# Altium project ODB2_scanner_PCB_Altium.PrjPcb
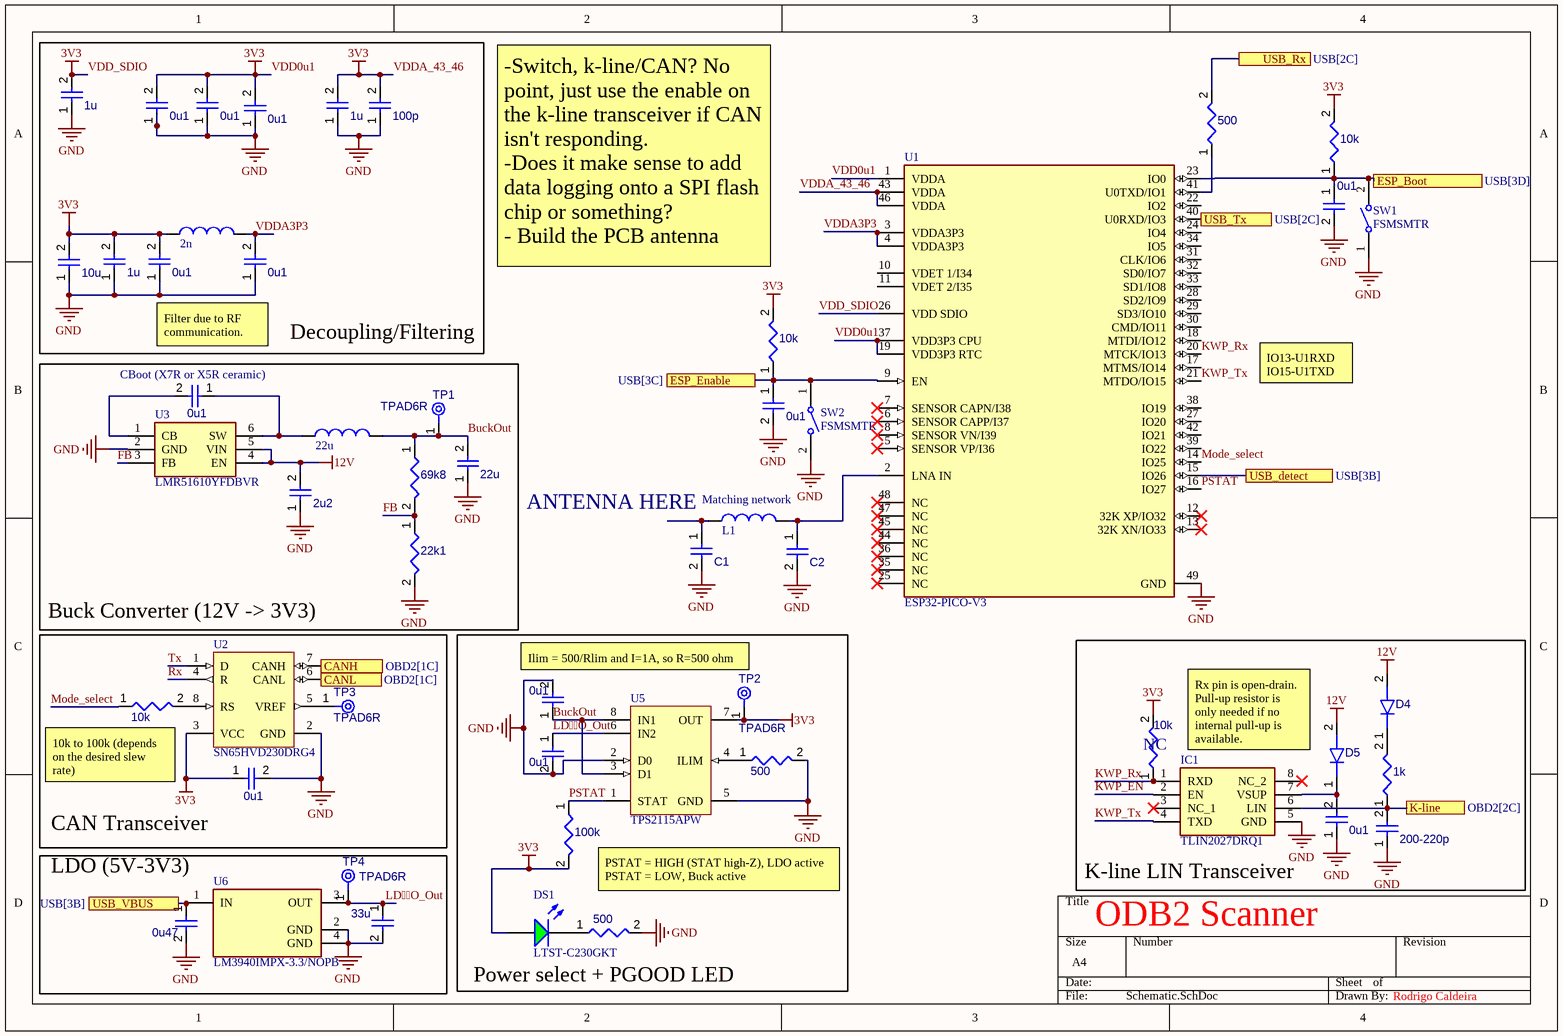
[diagram p0: Schematic.SchDoc]
3 sheets, 87 parts. Net scope: flat (ports and power ports of the same name join across sheets).
Sheets:
  Schematic.SchDoc
  USB.SchDoc
  OBD2.SchDoc

## Sheet Schematic.SchDoc
size A4; SheetNumber: 1; SheetTotal: 3

### Parts
(Parts that share a designator on the sheet are numbered #1, #2 ... from top to bottom, then left to right.)
0u1#1  Capacitors  (value not drawn)
0u1#2  Capacitors  (value not drawn)
0u1#3  Capacitors  (value not drawn)
0u1#4  Capacitors  (value not drawn)
0u1#5  Capacitors  (value not drawn)
0u1#6  Capacitors  (value not drawn)
0u1#7  Capacitors  (value not drawn)
0u1#8  Capacitors  (value not drawn)
0u1#9  Capacitors  (value not drawn)
0u1#10  Capacitors  (value not drawn)
0u1#11  Capacitors  (value not drawn)
0u1#12  Capacitors  (value not drawn)
0u47  Capacitors  (value not drawn)
1k#1  Resistors  (value not drawn)
1u#1  Capacitors  (value not drawn)
1u#2  Capacitors  (value not drawn)
1u#3  Capacitors  (value not drawn)
2n  Inductors  (value not drawn)
2u2  Capacitors  (value not drawn)
10k#1  Resistors  (value not drawn)
10k#2  Resistors  (value not drawn)
10k#3  Resistors  (value not drawn)
10k#4  Resistors  (value not drawn)
10u  Capacitors  (value not drawn)
22k1  Resistors  (value not drawn)
22u#1  Inductors  (value not drawn)
22u#2  Capacitors  (value not drawn)
33u  Capacitors  (value not drawn)
69k8  Resistors  (value not drawn)
100k#1  Resistors  (value not drawn)
100p  Capacitors  (value not drawn)
200-220p  Capacitors  (value not drawn)
500#1  Resistors  (value not drawn)
500#2  Resistors  (value not drawn)
500#3  Resistors  (value not drawn)
C1  Capacitors  (value not drawn)
C2  Capacitors  (value not drawn)
D4  Diodes  (value not drawn)
D5  Diodes  (value not drawn)
DS1  LTST-C230GKT  [LTST-C230KGKT_V]
IC1  TLIN2027DRQ1  [SOIC127P600X175-8N]
L1  Inductors  (value not drawn)
SW1  FSMSMTR  [TECO-FSMSMTR_V]
SW2  FSMSMTR  [TECO-FSMSMTR_V]
TP1  TPAD6R  [TP06R]  (no BOM)
TP2  TPAD6R  [TP06R]  (no BOM)
TP3  TPAD6R  [TP06R]  (no BOM)
TP4  TPAD6R  [TP06R]  (no BOM)
U1  ESP32-PICO-V3  [FP-ESP32-PICO-V3-MFG]
U2  SN65HVD230DRG4  [D8_N]
U3  LMR51610YFDBVR  [SOT95P280X145-6N]
U5  TPS2115APW  [PW0008A_M]
U6  LM3940IMPX-3.3/NOPB  [FP-DCY0004A-MFG]

### Blocks framed on the sheet
Decoupling/Filtering: 0u1#1-0u1#3 0u1#5 0u1#6 1u#1-1u#3 2n 10u 100p
Power select + PGOOD LED: 0u1#9 0u1#10 100k#1 500#2 500#3 DS1 TP2 U5
K-line LIN Transceiver: 0u1#12 1k#1 10k#4 200-220p D4 D5 IC1

### Ports
CANH (see OBD2[1C]), CANL (see OBD2[1C]), ESP_Boot (see USB[3D]), ESP_Enable (see USB[3C]), K-line (see OBD2[2C]), USB_detect (see USB[3B]), USB_Rx (see USB[2C]), USB_Tx (see USB[2C]), USB_VBUS (see USB[3B])

### Nets
12V: 2u2.2 D4.2(A) D5.2(A) U3.4(EN) U3.5(VIN)
GND: 0u1#1.1 0u1#2.1 0u1#3.1 0u1#4.2 0u1#5.1 0u1#6.1 0u1#7.2 0u1#9.2 0u1#10.2 0u1#11.2 0u1#12.1 0u47.2 1u#1.1 1u#2.1 1u#3.1 2u2.1 10u.1 22k1.2 22u#2.1 33u.2 100p.1 200-220p.1 500#2.2 500#3.2 C1.2 C2.2 IC1.5(GND) SW1.1 SW2.2 U1.49(GND) U2.2(GND) U3.2(GND) U5.2(D0) U5.5(GND) U6.2(GND) U6.4(GND)
VDD0u1: 0u1#1.2 0u1#2.2 0u1#3.2 0u1#5.2 0u1#11.1 1u#1.2 1u#2.2 1u#3.2 2n.1 10k#1.2 10k#2.2 10k#4.2 10u.2 100k#1.2 100p.2 DS1.1(A) TP2.1(TP) U1.1(VDDA) U1.19(VDD3P3_RTC) U1.26(VDD_SDIO) U1.37(VDD3P3_CPU) U1.43(VDDA) U1.46(VDDA) U2.3(VCC) U5.7(OUT)  [also labelled 3V3, VDD_SDIO, VDDA_43_46]
BuckOut: 0u1#9.1 22u#1.2 22u#2.2 69k8.1 TP1.1(TP) U5.3(D1) U5.8(IN1)
FB: 22k1.1 69k8.2 U3.3(FB)
KWP_EN: IC1.2(EN)
KWP_Rx: 10k#4.1 IC1.1(RXD) U1.20(MTCK/IO13)
KWP_Tx: IC1.4(TXD) U1.21(MTDO/IO15)
LDO_Out: 0u1#10.1 33u.1 TP4.1(TP) U5.6(IN2) U6.3(OUT)
Mode_select: 10k#3.1 U1.14(IO25)
PSTAT: 100k#1.1 U1.16(IO27) U5.1(STAT)
Rx: U2.4(R)
Tx: U2.1(D)
VBUS: 0u47.1 U6.1(IN) ; port USB_VBUS
VDDA3P3: 0u1#6.2 2n.2 U1.3(VDDA3P3) U1.4(VDDA3P3)
Net0u1#4_1: 0u1#4.1 10k#1.1 SW1.2 U1.23(IO0) ; port ESP_Boot
Net0u1#7_1: 0u1#7.1 10k#2.1 SW2.1 U1.9(EN) ; port ESP_Enable
Net0u1#8_1: 0u1#8.1 22u#1.1 U3.6(SW)
Net0u1#8_2: 0u1#8.2 U3.1(CB)
Net0u1#12_2: 0u1#12.2 D5.1(K) IC1.7(VSUP)
Net1k#1_1: 1k#1.1 200-220p.2 IC1.6(LIN) ; port K-line
Net1k#1_2: 1k#1.2 D4.1(K)
Net10k#3_2: 10k#3.2 U2.8(RS)
Net52k_2: U1.15(IO26) ; port USB_detect
Net500#1_1: 500#1.1 U1.41(U0TXD/IO1)
Net500#1_2: 500#1.2 ; port USB_Rx
Net500#2_1: 500#2.1 U5.4(ILIM)
Net500#3_1: 500#3.1 DS1.2(K)
NetC1_1: C1.1 L1.1
NetC2_1: C2.1 L1.2 U1.2(LNA_IN)
NetJ1_6: U2.7(CANH) ; port CANH
NetJ1_14: U2.6(CANL) ; port CANL
NetTP3_1: TP3.1(TP) U2.5(VREF)
NetU1_40: U1.40(U0RXD/IO3) ; port USB_Tx

Not connected (* = marked no-connect by the designer): IC1 3(NC_1)* 8(NC_2)*; U1 5(SENSOR_VP/I36)* 6(SENSOR_CAPP/I37)* 7(SENSOR_CAPN/I38)* 8(SENSOR_VN/I39)* 10(VDET_1/I34) 11(VDET_2/I35) 12(32K_XP/IO32)* 13(32K_XN/IO33)* 17(MTMS/IO14) 18(MTDI/IO12) 22(IO2) 24(IO4) 25(NC)* 27(IO20) 28(SD2/IO9) 29(SD3/IO10) 30(CMD/IO11) 31(CLK/IO6) 32(SD0/IO7) 33(SD1/IO8) 34(IO5) 35(NC)* 36(NC)* 38(IO19) 39(IO22) 42(IO21) 44(NC)* 45(NC)* 47(NC)* 48(NC)*

### Notes on the sheet
- -Switch, k-line/CAN? No point, just use the enable on the k-line transceiver if CAN isn't responding.
  -Does it make sense to add data logging onto a SPI flash chip or something?
  - Build the PCB antenna
- (near 0u1#8) CBoot (X7R or X5R ceramic)
- (near 0u1#6) Filter due to RF communication.
- IO13-U1RXD
  IO15-U1TXD
- ANTENNA HERE
- (near L1) Matching network
- (near U2) Buck Converter (12V -> 3V3)
- Ilim = 500/Rlim and I=1A, so R=500 ohm
- (near 10k#3) 10k to 100k (depends on the desired slew rate)
- (near 10k#4) NC
- Rx pin is open-drain. Pull-up resistor is only needed if no internal pull-up is available.
- CAN Transceiver
- LDO (5V-3V3)
- PSTAT = HIGH (STAT high-Z), LDO active
  PSTAT = LOW, Buck active
- ODB2 Scanner
- Rodrigo Caldeira

### Library data of the parts
0u1#1-0u1#12 0u47 1u#1-1u#3 2u2 22u#2 33u 100p 200-220p C1 C2 = Capacitors: Capacitor; Component Type: Capacitors
1k#1 10k#1-10k#4 22k1 69k8 100k#1 500#1-500#3 = Resistors: Resistor; Component Type: Resistors
10u = Capacitors: Polarized Electrolitic Capacitor; Component Type: Capacitors
D4 D5 = Diodes: Diode; Component Type: Diodes
DS1 = CMP-2000-06625-1: LED Green, 75 mW, 30 mA, -30 to 85 degC, 2-Pin SMD, RoHS, Tape and Reel; Manufacturer: Lite-On; Product Length (mm): 3.2mm; Type: Uni-Color; Peak Wavelength: 574nm; Shape Type: Rectangular; DELETED: Compliant; Lum Intensity: 35mcd; Forward Voltage: 2.4V; High Brightness: Yes; Rad Hardened: No; Power Dissipation: 75W; Forward Current: 30mA; Emitting Color: YellowGreen; Main Category: ChipLED; Product Height (mm): 1.1mm; Product Depth (mm): 1.6mm; Number of  Elements: 1; Viewing Angle: 130deg; Chip Material: AlGaInP; Dominant Wave Length: 571nm; Test Current (It): 20mA; Reverse Voltage: 5V; Mounting: SurfaceMount; Datasheet URL: http://optoelectronics.liteon.com/upload/download/DS22-2000-256/S_110_LTST-C230KGKT.pdf; Luminous Intensity: 35mcd; Pin Count: 2; Mounting Technology: SurfaceMount; Operating Temperature Classification: Industrial; Operating Temp Range: -55Cto85C; Package Type: ChipLed; Manufacturer URL: http://www.us.liteon.com/; Package Description: 2-Pin Surface Mount Device, Body 3.2 x 1.6 mm; Package Reference: C230KGKT; Datasheet Version: Rev. G, 12/2014; Lens Dimensions: 1.5X1.6X0.82mm; Packaging: TapeandReel
IC1 = TLIN2027DRQ1: Integrated Circuit; Manufacturer_Name: Texas Instruments; Datasheet Link: https://www.arrow.com/en/products/tlin2027drq1/texas-instruments; Height: 1.75mm; Manufacturer_Part_Number: TLIN2027DRQ1; Mouser Part Number: 595-TLIN2027DRQ1; Mouser Price/Stock: https://www.mouser.co.uk/ProductDetail/Texas-Instruments/TLIN2027DRQ1?qs=81r%252BiQLm7BR5Em8N%252BNvRQg%3D%3D; Arrow Part Number: TLIN2027DRQ1; Arrow Price/Stock: https://www.arrow.com/en/products/tlin2027drq1/texas-instruments?region=nac
SW1 SW2 = CMP-2000-07501-1: FSMSM Push Button Switch, 50 mA, -35 to 85 degC, 2-Pin SMD, RoHS, Tape and Reel; Manufacturer: TE Connectivity; Voltage Rating (DC): 24V; Electrical Life: 20000Cycles; Operating Force: 180gf; Switch Travel: 0.25mm; Contact Current Rating: 50mA; Case\/Package: SMD/SMT; Actuator Length: 1.07mm; Throw Configuration: SPST; Actuator Material: Polyamide; Contact Resistance: 100mOhm; Illumination Type: Illuminated; Max Voltage Rating (DC): 12V; Manufacturer URL: http://www.te.com/; Lead Free: LeadFree; Packaging: TapeandReel; Min Operating Temperature: -35degC; Mechanical Life: 20000Cycles; Mount: SurfaceMount; REACH SVHC: Unknown; Package Quantity: 1800; Package Reference: FSMSMTR; RoHSCompliant: true; Max Operating Temperature: 85degC; Orientation: Straight; ELV: Compliant; Datasheet URL: http://www.te.com/commerce/DocumentDelivery/DDEController?Action=showdoc&DocId=Customer+Drawing%7F1437566-3%7FC2%7Fpdf%7FEnglish%7FENG_CD_1437566-3_C2_1437566_3_1_c.dwg.pdf%7F1437566-4; Package Description: 2-Pin Surface Mount Device, Body 6 x 3.5 mm, Pitch 9.19 mm; Current Rating: 50mA; Contact Plating: Silver; Termination: GullWing; Datasheet Version: Rev. C2, 08/2014; Contact Material: Brass; Mounting Technology: SurfaceMount
TP1-TP4 = CMP-00028-00002-2: 0.6mm round; Pins: 1
U1 = CMP-194065-000030-1: RX TXRX MOD WIFI SURFACE MOUNT
U2 = CMP-0315-00017-1: 3.3 V CAN Transceiver with Standby Mode, 17 mA, -40 to 85 degC, 8-pin SOIC (D), Green (RoHS & no Sb/Br); Manufacturer: Texas Instruments; Receivers Per Package: 1; Rating: Catalog; Transient Pulse Protection(V): -25 to 25; Supply Voltage(s)(V): 3.3; ICC(Max)(mA): 17; Code_JEDEC: MS-012AA; PackageVersion: revM, Jun-2011; Eco-Plan: Green (RoHS & no Sb/Br); SubFamily: CAN; ComponentLink1Description: Datasheet; Footprint: PCA82C250; PackageReference: D8; PartNumber: SN65HVD230DRG4; DatasheetVersion: SLOS346K; Mounting Technology: Surface Mount; ComponentLink1URL: http://www.ti.com/general/docs/lit/getliterature.tsp?genericPartNumber=SN65HVD230&fileType=pdf; Isolated: No; Drivers Per Package: 1; PackageDescription: 8-Pin Plastic Small Outline Integrated Circuit, 4.9 x 3.9 mm, Pitch 1.27 mm Pitch; Low Power Mode: Standby
U3 = LMR51610YFDBVR: Integrated Circuit; Manufacturer_Name: Texas Instruments; Datasheet Link: https://www.ti.com/lit/ds/symlink/lmr51610.pdf?ts=1727151330338&ref_url=https%253A%252F%252Fwww.mouser.in%252F; Height: 1.45mm; Manufacturer_Part_Number: LMR51610YFDBVR; Mouser Part Number: 595-LMR51610YFDBVR; Mouser Price/Stock: https://www.mouser.co.uk/ProductDetail/Texas-Instruments/LMR51610YFDBVR?qs=dbcCsuKDzFWbILGJVHCR7g%3D%3D; Arrow Part Number: LMR51610YFDBVR; Arrow Price/Stock: https://www.arrow.com/en/products/lmr51610yfdbvr/texas-instruments?utm_currency=USD&region=nac
U5 = CMP-0339-00017-2: Dual In / Single Out Autoswitching Power Mux, 2.8 to 5.5 V, -40 to 85 degC, 8-pin TSSOP (PW), Green (RoHS & no Sb/Br); Manufacturer: Texas Instruments; Number of Inputs: 2; IN1, IN2 Input Voltage(Min)(V): 2.8; IN1 Output Current(Max)(A): 1.25; SubFamily: Power Multiplexer (MUX); IN1, IN2 Input Voltage(Max)(V): 5.5; IN1 rDS(on)(Typ)(mOhm): 84; IN2 rDS(on)(Typ)(Ohms): 0.084; ComponentLink1URL: http://www.ti.com/general/docs/lit/getliterature.tsp?genericPartNumber=TPS2115A&fileType=pdf; Code_JEDEC: MO-153; Eco-Plan: Green (RoHS & no Sb/Br); PackageVersion: revG, Feb-2011; PartNumber: TPS2115APW; DatasheetVersion: SBVS044F; PackageDescription: 8-Pin Plastic Thin Small Outline Package 3 x 4.4 mm Body ,0.65 mm Pitch; Mounting Technology: Surface Mount; ComponentLink1Description: Datasheet; PackageReference: PW0008A; IN2 Output Current(Max)(A): 1.25
U6 = CMP-04917-000180-1: IC REG LINEAR 3.3V 1A SOT223-4; Polarity: Positive; Dropout Voltage: 500mV; Number of Regulators: 1; Min Input Voltage: 4.5V; Quiescent Current: 15mA; Output Type: Fixed; Max Input Voltage: 7.5V; Packaging: Tape and Reel; Mount: Surface Mount; Number of Pins: 4; Package Quantity: 2000; Output Current: 1A; Min Operating Temperature: -40°C; Contact Plating: Tin; Max Output Current: 1A; Radiation Hardening: No; Output Voltage: 3.3V; Lead Free: Lead Free; Case/Package: SOT-223; Number of Outputs: 1; Max Operating Temperature: 125°C; RoHS Compliant: Yes
2n 22u#1 L1 = Inductors: Component Type: Inductors

## Sheet USB.SchDoc
size A4; SheetNumber: 2; SheetTotal: 3
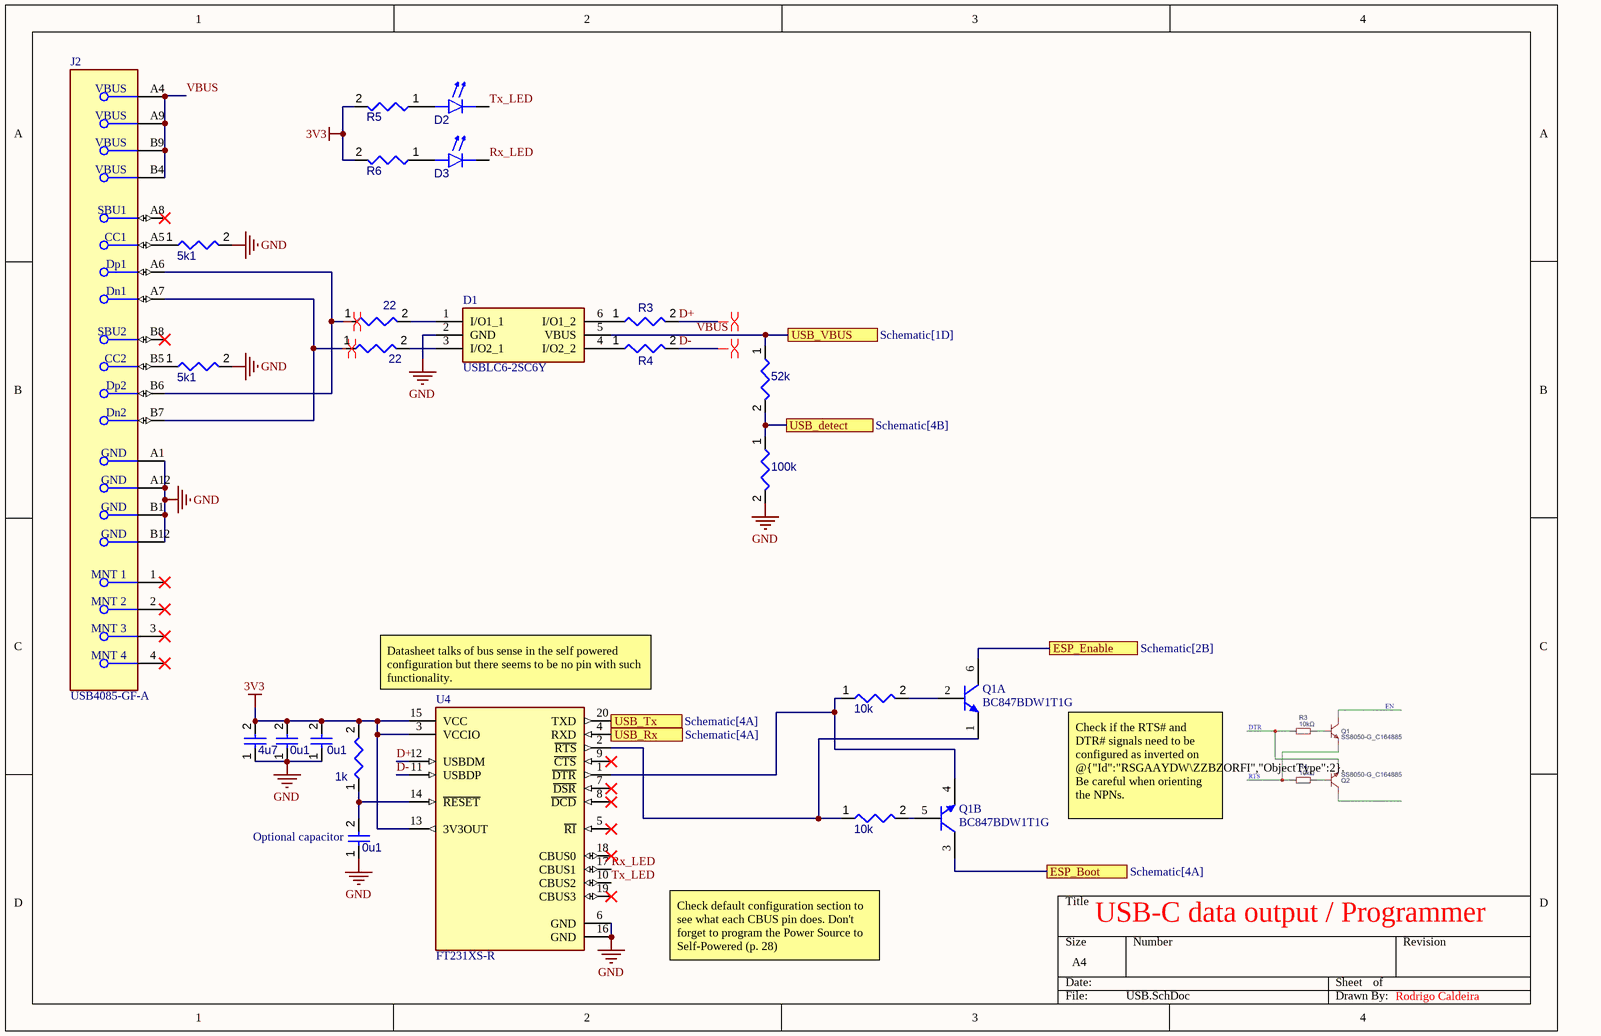
[diagram p1: USB.SchDoc]

### Parts
(Parts that share a designator on the sheet are numbered #1, #2 ... from top to bottom, then left to right.)
0u1#13  Capacitors  (value not drawn)
0u1#14  Capacitors  (value not drawn)
0u1#15  Capacitors  (value not drawn)
1k#2  Resistors  (value not drawn)
4u7  Capacitors  (value not drawn)
5k1#1  Resistors  (value not drawn)
5k1#2  Resistors  (value not drawn)
10k#5  Resistors  (value not drawn)
10k#6  Resistors  (value not drawn)
22#1  Resistors  (value not drawn)
22#2  Resistors  (value not drawn)
52k  Resistors  (value not drawn)
100k#2  Resistors  (value not drawn)
D1  USBLC6-2SC6Y  [SOT95P280X145-6N]
D2  LED  (value not drawn)
D3  LED  (value not drawn)
J2  USB4085-GF-A  [FP-USB4085-GF-A-MFG]
Q1  BC847BDW1T1G  [ONSC-SOT-363-6-419B-02_W_V]  (parts A,B of 2)
R3  Resistors  (value not drawn)
R4  Resistors  (value not drawn)
R5  Resistors  (value not drawn)
R6  Resistors  (value not drawn)
U4  FT231XS-R  [FP-SSOP-20-MFG]

### Ports
ESP_Boot (see Schematic[4A]), ESP_Enable (see Schematic[2B]), USB_detect (see Schematic[4B]), USB_Rx (see Schematic[4A]), USB_Tx (see Schematic[4A]), USB_VBUS (see Schematic[1D])

### Nets
3V3: 0u1#13.2 0u1#14.2 1k#2.2 4u7.2 R5.2 R6.2 U4.3(VCCIO) U4.13(3V3OUT) U4.15(VCC)  [project net VDD0u1]
GND: 0u1#13.1 0u1#14.1 0u1#15.1 4u7.1 5k1#1.2 5k1#2.2 100k#2.2 D1.2(GND) J2.A1(GND) J2.A12(GND) J2.B1(GND) J2.B12(GND) U4.6(GND) U4.16(GND)
D+: R3.2 U4.12(USBDM)
D-: R4.2 U4.11(USBDP)
Rx_LED: D3.1(K) U4.17(CBUS1)
Tx_LED: D2.1(K) U4.10(CBUS2)
VBUS: 52k.1 D1.5(VBUS) J2.A4(VBUS) J2.A9(VBUS) J2.B4(VBUS) J2.B9(VBUS) ; port USB_VBUS
Net0u1#4_1: Q1.3(C) ; port ESP_Boot
Net0u1#7_1: Q1.6(C) ; port ESP_Enable
Net0u1#15_2: 0u1#15.2 1k#2.1 U4.14(~{RESET})
Net5k1#1_1: 5k1#1.1 J2.A5(CC1)
Net5k1#2_1: 5k1#2.1 J2.B5(CC2)
Net10k#5_1: 10k#5.1 Q1.4(E) U4.1(~{DTR})
Net10k#5_2: 10k#5.2 Q1.2(B)
Net10k#6_1: 10k#6.1 Q1.1(E) U4.2(~{RTS})
Net10k#6_2: 10k#6.2 Q1.5(B)
Net22#1_1: 22#1.1 J2.A6(Dp1) J2.B6(Dp2)
Net22#1_2: 22#1.2 D1.1(I/O1_1)
Net22#2_1: 22#2.1 J2.A7(Dn1) J2.B7(Dn2)
Net22#2_2: 22#2.2 D1.3(I/O2_1)
Net52k_2: 52k.2 100k#2.1 ; port USB_detect
Net500#1_2: U4.4(RXD) ; port USB_Rx
NetD1_4: D1.4(I/O2_2) R4.1
NetD1_6: D1.6(I/O1_2) R3.1
NetD2_2: D2.2(A) R5.1
NetD3_2: D3.2(A) R6.1
NetU1_40: U4.20(TXD) ; port USB_Tx

Not connected (* = marked no-connect by the designer): J2 1(MNT_1)* 2(MNT_2)* 3(MNT_3)* 4(MNT_4)* A8(SBU1)* B8(SBU2)*; U4 5(~{RI})* 7(~{DSR})* 8(~{DCD})* 9(~{CTS})* 18(CBUS0)* 19(CBUS3)*

### Layout directives
differential pair: D+, D-, Net22#1_1, Net22#2_1

### Notes on the sheet
- (near U4) Datasheet talks of bus sense in the self powered configuration but there seems to be no pin with such functionality.
- (near 0u1#15) Optional capacitor
- Check if the RTS# and DTR# signals need to be configured as inverted on @{"Id":"RSGAAYDW\ZZBZORFI","ObjectType":2}.
  Be careful when orienting the NPNs.
- Check default configuration section to see what each CBUS pin does. Don't forget to program the Power Source to Self-Powered (p. 28)
- USB-C data output / Programmer
- Rodrigo Caldeira

### Library data of the parts
0u1#13-0u1#15 4u7 = Capacitors: Capacitor; Component Type: Capacitors
1k#2 5k1#1 5k1#2 10k#5 10k#6 22#1 22#2 52k R3-R6 = Resistors: Resistor; Component Type: Resistors
D1 = USBLC6-2SC6Y: Diode; Manufacturer_Name: STMicroelectronics; Datasheet Link: https://componentsearchengine.com/Datasheets/1/USBLC6-2SC6Y.pdf; Height: 1.45mm; Manufacturer_Part_Number: USBLC6-2SC6Y; Mouser Part Number: 511-USBLC6-2SC6Y; Mouser Price/Stock: https://www.mouser.co.uk/ProductDetail/STMicroelectronics/USBLC6-2SC6Y?qs=gNDSiZmRJS%2FOgDexvXkdow%3D%3D; Arrow Part Number: USBLC6-2SC6Y; Arrow Price/Stock: https://www.arrow.com/en/products/usblc6-2sc6y/stmicroelectronics?utm_currency=USD&region=nac
D2 D3 = LED: Light-emitting Diode; Component Type: LED
J2 = CMP-196119-000001-2: CONN RCPT USB2.0 TYPE C 24POS RA; Gender: Receptacle; Number of Positions: 16; USB Standard: USB 2.0; Orientation: Right Angle; Contact Plating: Gold; Contact Material: Copper Alloy
Q1 = CMP-1048-00875-1: Dual General Purpose Transistors, NPN, 6-Pin SOT-363, Pb-Free, Tape and Reel; Manufacturer: On Semiconductor; fT Min (MHz): 100; IC Continuous (A): 0.1; Polarity: Dual NPN; ComponentLink3Description: Package Specification; PackageReference: SOT-363-6-419B-02_W; RoHS: TRUE; PackageVersion: Rev. W, 01/2006; Packing: Tape and Reel; Mounting Technology: Surface Mount; ComponentLink3URL: http://www.onsemi.com/pub_link/Collateral/NTJD4001N-D.PDF; ComponentLink2URL: http://www.onsemi.cn/pub_link/Collateral/BC846BDW1T1-D.PDF; ComponentLink2Description: Datasheet; ComponentLink1Description: Manufacturer URL; PartNumber: BC847BDW1T1G; DatasheetVersion: Rev. 9; PackageDescription: 6-Pin Small Outline Transistor, Body 2 x 1.25 mm, Pitch 0.65 mm; ComponentLink1URL: http://www.onsemi.com/
U4 = CMP-0248-00024-3: IC USB SERIAL FULL UART 20SSOP; Operating Supply Voltage: 5V; Operating Supply Current: 8mA; Number of Channels: 1; Min Supply Voltage: 2.97V; Max Supply Voltage: 5.5V; Data Rate: 12Mbps; Height: 0.059inch; Packaging: Tape and Reel; Mount: Surface Mount; Package Quantity: 2000; Radiation Hardening: No; Case/Package: SSOP; Min Operating Temperature: -40°C; Width: 0.157inch; Number of Pins: 20; Weight: 0.016oz; Interface: UART; Max Operating Temperature: 85°C; Length: 8.74mm
100k#2 = Resistors: Component Type: Resistors

## Sheet OBD2.SchDoc
size A4; SheetNumber: 3; SheetTotal: 3
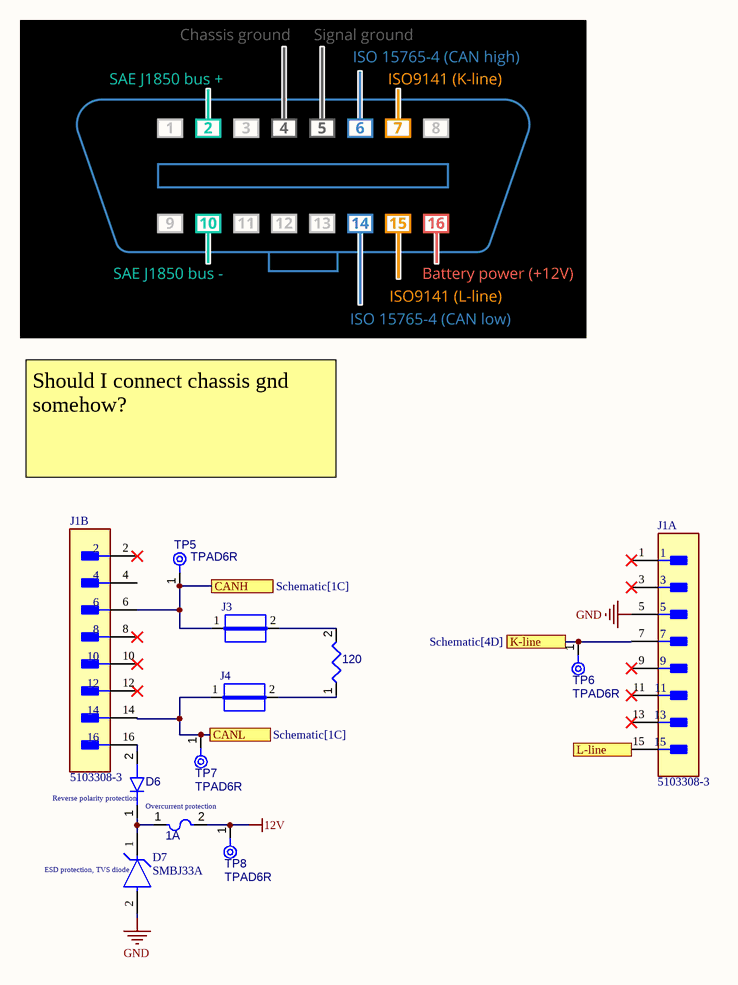
[diagram p2: OBD2.SchDoc]

### Parts
1A  Fuses  (value not drawn)
120  Resistors  (value not drawn)
D6  Diodes  (value not drawn)
D7  SMBJ33A  [FP-SMBJ-MFG]
J1  5103308-3  [FP-5103308-3-MFG]  (parts A,B of 2)
J3  JUMPER  [JUMPER]  (value not drawn)
J4  JUMPER  [JUMPER]  (value not drawn)
TP5  TPAD6R  [TP06R]  (no BOM)
TP6  TPAD6R  [TP06R]  (no BOM)
TP7  TPAD6R  [TP06R]  (no BOM)
TP8  TPAD6R  [TP06R]  (no BOM)

### Ports
CANH (see Schematic[1C]), CANL (see Schematic[1C]), K-line (see Schematic[4D]), L-line

### Nets
12V: 1A.2 TP8.1(TP)
GND: D7.2(A) J1.5
Net1A_1: 1A.1 D6.1(K) D7.1(C)
Net1k#1_1: J1.7 TP6.1(TP) ; port K-line
Net120_1: 120.1 J4.2
Net120_2: 120.2 J3.2
NetD6_2: D6.2(A) J1.16
NetJ1_6: J1.6 J3.1 TP5.1(TP) ; port CANH
NetJ1_14: J1.14 J4.1 TP7.1(TP) ; port CANL
NetJ1_15: J1.15 ; port L-line

Not connected (* = marked no-connect by the designer): J1 1* 2* 3* 4 8* 9* 10* 11* 12* 13*

### Notes on the sheet
- Should I connect chassis gnd somehow?
- (near D6) Reverse polarity protection
- Overcurrent protection
- (near D7) ESD protection, TVS diode

### Library data of the parts
1A = Fuses: Fuse; Component Type: Fuses
120 = Resistors: Resistor; Component Type: Resistors
D6 = Diodes: Diode; Component Type: Diodes
D7 = CMP-2000-07095-2: TVS DIODE 33V 53.3V DO214AA; Manufacturer: Littelfuse Inc; Max Junction Temp: +150°C; Number Of Channels: 1; Breakdown Voltage: 36.7V; Description: 53.3V Clamp 11.3A Ipp Tvs Diode Surface Mount DO-214AA (SMBJ); Peak Pulse Power: 600W; Direction: Unidirectional; Peak Pulse Current: 11.3A; Lead Free: Yes; Height: 2.61mm; Temperature Range Low: -65°C; ComponentLink2URL: https://www.littelfuse.com/~/media/electronics/datasheets/tvs_diodes/littelfuse_tvs_diode_smbj_datasheet.pdf.pdf; Manufacturer Part Number: SMBJ33A; Clamping Voltage: 53.3V; Device Class L1: Circuit Protection; Octopart: https://octopart.com/smbj33a-littelfuse-350829; Device Class L2: TVS Diodes; Digikey Description: TVS DIODE 33V 53.3V DO214AA; Automotive: No; Temperature Range High: +150°C; Package: SMBJ; ComponentLink2Description: Datasheet; Mouser Description: TVS DIODE 33V 53.3V DO214AA; Reverse Standoff Voltage: 33V; Category: Diode; Device Class L3: unset; Temperature: -65°C to +150°C; RoHS: TRUE
J1 = CMP-03369-000164-1: CONN HEADER VERT 16POS 2.54MM; Number of Positions: 16; Packaging: Rail/Tube; Flammability Rating: UL94 V-0; Contact Finish - Mating: Gold or Gold-Palladium; Max Operating Temperature: 105°C; Contact Shape: Square; Connector Type: Header; Termination: Solder; Fastening Type: Pull; Insulation Color: Black; Min Operating Temperature: -65°C; RoHS Compliant: Yes; Contact Type: Male Pin; Series: AMP-LATCH; Mount: Through Hole; Number of Rows: 2; Contact Material: Brass
J3 J4 = CMP-009-00061-2: Pins: 2
TP5-TP8 = CMP-00028-00002-2: 0.6mm round; Pins: 1

## Nets that join several sheets
12V: Schematic (5 pins), OBD2 (1A.2 TP8.1)
GND: Schematic (36 pins), USB (14 pins), OBD2 (D7.2 J1.5)
VDD0u1: Schematic (25 pins), USB (9 pins)
Net0u1#4_1: Schematic (0u1#4.1 10k#1.1 SW1.2 U1.23), USB (Q1.3)
Net0u1#7_1: Schematic (0u1#7.1 10k#2.1 SW2.1 U1.9), USB (Q1.6)
Net1k#1_1: Schematic (1k#1.1 200-220p.2 IC1.6), OBD2 (J1.7 TP6.1)
Net52k_2: Schematic (U1.15), USB (52k.2 100k#2.1)
Net500#1_2: Schematic (500#1.2), USB (U4.4)
NetJ1_6: Schematic (U2.7), OBD2 (J1.6 J3.1 TP5.1)
NetJ1_14: Schematic (U2.6), OBD2 (J1.14 J4.1 TP7.1)
NetU1_40: Schematic (U1.40), USB (U4.20)
VBUS: Schematic (0u47.1 U6.1), USB (6 pins)